# EAGLE design TBEAM_V10_Simple (EAGLE 9.6.2)

## Sheet 1 of 2
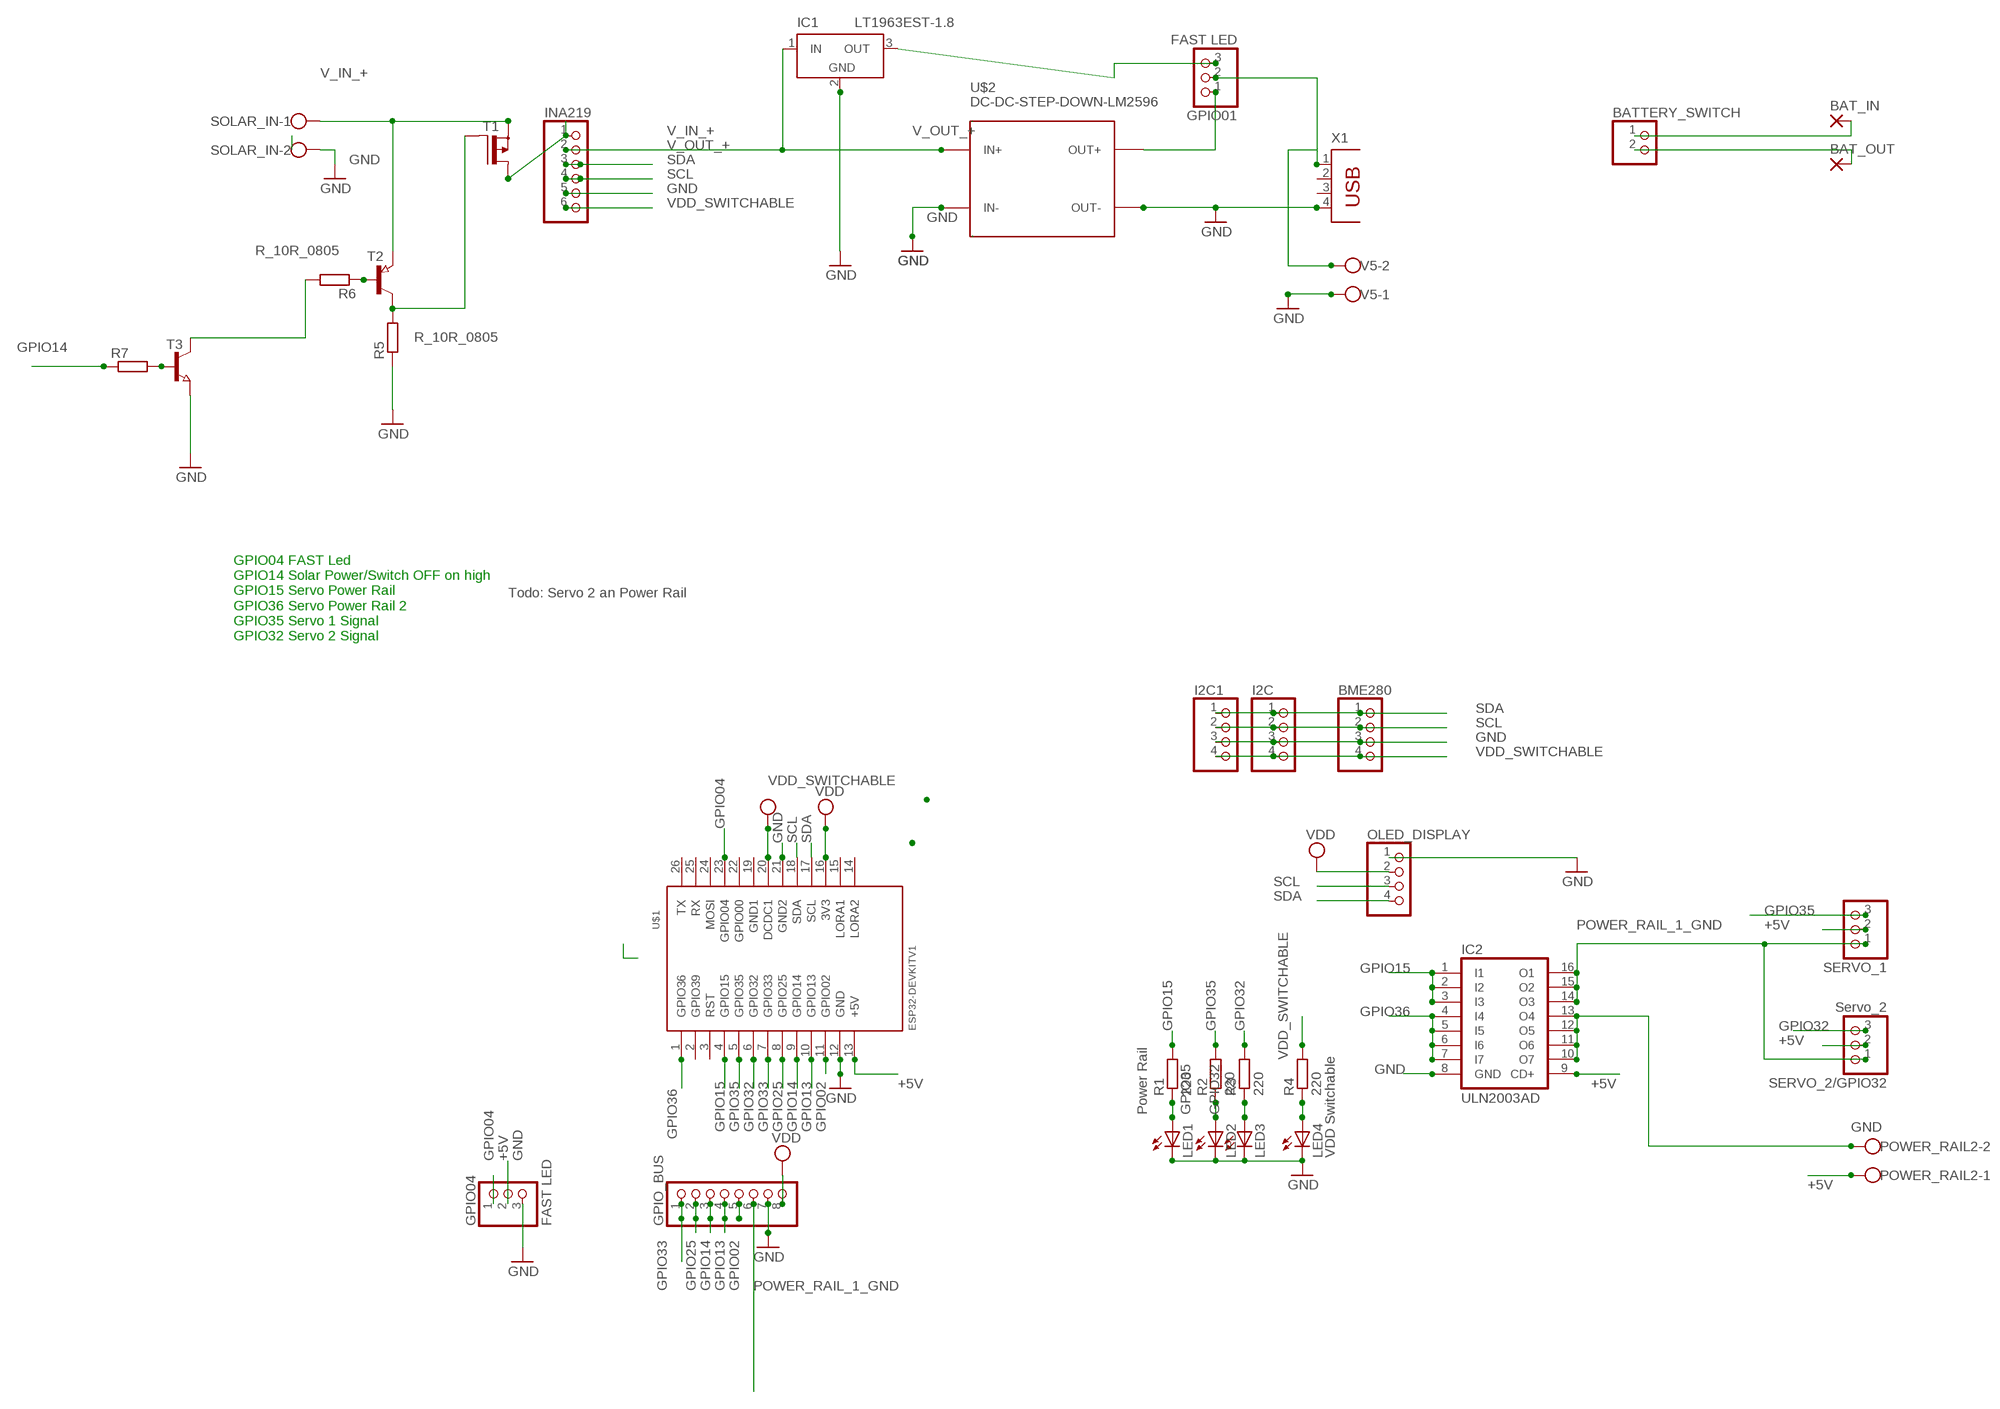
[diagram p0: schematic, sheet 1]

### Parts
BAT_IN  SMD5  [SMD2,54-5,08]
BAT_OUT  SMD5  [SMD2,54-5,08]
BATTERY_SWITCH  PINHD-1X2  [1X02]
BME280  PINHD-1X4  [1X04]
GPIO01  FAST LED  PINHD-1X3  [1X03]
GPIO04  FAST LED  PINHD-1X3  [1X03]
GPIO_BUS  PINHD-1X8  [1X08]
I2C  PINHD-1X4  [1X04]
I2C1  PINHD-1X4  [1X04]
IC1  LT1963EST-1.8  [SOT223]
IC2  ULN2003AD  [SO16]
INA219  PINHD-1X6  [1X06]
LED1  Power Rail  LEDSML1206  [SML1206]
LED2  GPIO35  LEDSML1206  [SML1206]
LED3  GPIO32  LEDSML1206  [SML1206]
LED4  VDD Switchable  LEDSML1206  [SML1206]
OLED_DISPLAY  PINHD-1X4  [1X04]
POWER_RAIL2  W237-102  [W237-102]
R1  220  R-EU_R1206  [R1206]
R2  220  R-EU_R1206  [R1206]
R3  220  R-EU_R1206  [R1206]
R4  220  R-EU_R1206  [R1206]
R5  R_10R_0805  [R0805]
R6  R_10R_0805  [R0805]
R7  R_1.8K_0805  [R0805]
R8  R_1.8K_0805  [R0805]
SERVO_1  PINHD-1X3  [1X03]
SERVO_2/GPIO32  Servo_2  PINHD-1X3  [1X03]
SOLAR_IN  W237-102  [W237-102]
T1  T_P-MOSFET_AO3401A_ALPHA_SOT23-GSD  [SOT23]
T2  T_PNP_SS8550-Y2_CHANGJ_SOT23-BEC  [SOT23]
T3  T_NPN_SS8050_CHANGJ_SOT23-BEC  [SOT23]
U$1  ESP32DEVKITV1  [ESP32-DEVKITV1]
U$2  DC-DC-STEP-DOWN-LM2596  [DC-DC-STEP-DOWN-LM2596]
V5  W237-102  [W237-102]
X1  PN87520  [PN87520]

### Nets
+5V: GPIO04.2 IC2.9(CD+) POWER_RAIL2.1 SERVO_1.2 SERVO_2/GPIO32.2 U$1.13(+5V)
BUCK-CONVERTER: GPIO01.1 U$2.OUT+
GND: BME280.3 GPIO04.3 GPIO_BUS.7 I2C1.3 I2C.3 IC1.2(GND) IC2.8(GND) INA219.5 LED1.C LED2.C LED3.C LED4.C OLED_DISPLAY.1 R5.1 SOLAR_IN.2 T3.2(E) U$1.12(GND) U$1.21(GND2) U$2.IN- U$2.OUT- V5.1 X1.4
GPIO02: GPIO_BUS.5 U$1.11(GPIO02)
GPIO04: GPIO04.1 U$1.23(GPIO04)
GPIO13: GPIO_BUS.4 U$1.10(GPIO13)
GPIO14: GPIO_BUS.3 R7.1 R8.1 U$1.9(GPIO14)
GPIO15: IC2.1(I1) IC2.2(I2) IC2.3(I3) R1.2 U$1.4(GPIO15)
GPIO25: GPIO_BUS.2 U$1.8(GPIO25)
GPIO32: R3.2 SERVO_2/GPIO32.3 U$1.6(GPIO32)
GPIO33: GPIO_BUS.1 U$1.7(GPIO33)
GPIO35: R2.2 SERVO_1.3 U$1.5(GPIO35)
GPIO36: IC2.4(I4) IC2.5(I5) IC2.6(I6) IC2.7(I7) U$1.1(GPIO36)
N$4: LED1.A R1.1
N$5: LED2.A R2.1
N$6: LED3.A R3.1
N$8: GPIO01.2 V5.2 X1.1
N$9: BAT_IN.1(P) BATTERY_SWITCH.1
N$10: BAT_OUT.1(P) BATTERY_SWITCH.2
N$11: LED4.A R4.1
N$12: IC2.10(O7) IC2.11(O6) IC2.12(O5) IC2.13(O4) POWER_RAIL2.2
N$13: SOLAR_IN.1 T1.2(S) T2.2(E)
N$14: GPIO01.3 IC1.3(OUT)
N$15: R5.2 T1.1(G) T2.3(C)
N$16: R6.1 T2.1(B)
N$17: R6.2 T3.3(C)
N$18: R7.2 R8.2 T3.1(B)
POWER_RAIL_1_GND: GPIO_BUS.6 IC2.14(O3) IC2.15(O2) IC2.16(O1) SERVO_1.1 SERVO_2/GPIO32.1
SCL: BME280.2 I2C1.2 I2C.2 INA219.4 OLED_DISPLAY.3 U$1.18(SDA)
SDA: BME280.1 I2C1.1 I2C.1 INA219.3 OLED_DISPLAY.4 U$1.17(SCL)
V_IN_+: INA219.1 T1.3(D)
V_OUT_+: IC1.1(IN) INA219.2 U$2.IN+
VDD: GPIO_BUS.8 OLED_DISPLAY.2 U$1.16(3V3)
VDD_SWITCHABLE: BME280.4 I2C1.4 I2C.4 INA219.6 R4.2 U$1.20(DCDC1) ; supply symbol labelled VDD
Unconnected: U$1.2(GPIO39) U$1.3(RST) U$1.14(LORA2) U$1.15(LORA1) U$1.19(GND1) U$1.22(GPIO00) U$1.24(MOSI) U$1.25(RX) U$1.26(TX) X1.2 X1.3

### Notes on the sheet
- Todo: Servo 2 an Power Rail
- GPIO04 FAST Led
  GPIO14 Solar Power/Switch OFF on high
  GPIO15 Servo Power Rail
  GPIO36 Servo Power Rail 2
  GPIO35 Servo 1 Signal
  GPIO32 Servo 2 Signal

## Sheet 2 of 2

## Power pins joined to a net without a drawn wire
GND: IC1.4(GND)

## Library data of the parts
BAT_IN BAT_OUT = wirepad:SMD5: SMD PAD
BATTERY_SWITCH = pinhead:PINHD-1X2: PIN HEADER
BME280 I2C I2C1 OLED_DISPLAY = pinhead:PINHD-1X4: PIN HEADER
GPIO01 GPIO04 SERVO_1 SERVO_2/GPIO32 = pinhead:PINHD-1X3: PIN HEADER
GPIO_BUS = pinhead:PINHD-1X8: PIN HEADER
IC1 = linear-technology:LT1963EST: 1.5A, Low Noise, Fast Transient Response LDO Regulator Source: http://www.linear.com/pc/downloadDocument.do?navId=H0,C3,P2222,D3148; MPN: LT1963EST-1.8; OC_FARNELL: 1503436; OC_NEWARK: 57M7538
IC2 = uln-udn:ULN2003A: DRIVER ARRAY
INA219 = pinhead:PINHD-1X6: PIN HEADER
LED1-LED4 = led:LED: LED OSRAM: - CHIPLED LG R971, LG N971, LY N971, LG Q971, LY Q971, LO R971, LY R971 LH N974, LH R974 LS Q976, LO Q976, LY Q976 LO Q996 - Hyper CHIPLED LW Q18S LB Q993, LB Q99A, LB R99A - SideLED LS A670, LO A670, LY A670, LG A670, LP A670 LB A673, LV A673, LT A673, LW A673 LH A674 LY A675 LS A676, LA A676, LO A676, LY A676, LW A676 LS A679, LY A679, LG A679 - Hyper Micro SIDELED® LS Y876, LA Y876, LO Y876, LY Y876 LT Y87S - SmartLED LW L88C, LW L88S LB L89C, LB L89S, LG L890 LS L89K, LO L89K, LY L89K LS L896, LA L896, LO L896, LY L896 - TOPLED LS T670, LO T670, LY T670, LG T670, LP T670 LSG T670, LSP T670, LSY T670, LOP T670, LYG T670 LG T671, LOG T671, LSG T671 LB T673, LV T673, LT T673, LW T673 LH T674 LS T676, LA T676, LO T676, LY T676, LB T676, LH T676, LSB T676, LW T676 LB T67C, LV T67C, LT T67C, LS T67K, LO T67K, LY T67K, LW E67C LS E67B, LA E67B, LO E67B, LY E67B, LB E67C, LV E67C, LT E67C LW T67C LS T679, LY T679, LG T679 LS T770, LO T770, LY T770, LG T770, LP T770 LB T773, LV T773, LT T773, LW T773 LH T774 LS E675, LA E675, LY E675, LS T675 LS T776, LA T776, LO T776, LY T776, LB T776 LHGB T686 LT T68C, LB T68C - Hyper Mini TOPLED® LB M676 - Mini TOPLED Santana® LG M470 LS M47K, LO M47K, LY M47K Source: http://www.osram.convergy.de LUXEON: - LUMILED® LXK2-PW12-R00, LXK2-PW12-S00, LXK2-PW14-U00, LXK2-PW14-V00 LXK2-PM12-R00, LXK2-PM12-S00, LXK2-PM14-U00 LXK2-PE12-Q00, LXK2-PE12-R00, LXK2-PE12-S00, LXK2-PE14-T00, LXK2-PE14-U00 LXK2-PB12-K00, LXK2-PB12-L00, LXK2-PB12-M00, LXK2-PB14-N00, LXK2-PB14-P00, LXK2-PB14-Q00 LXK2-PR12-L00, LXK2-PR12-M00, LXK2-PR14-Q00, LXK2-PR14-R00 LXK2-PD12-Q00, LXK2-PD12-R00, LXK2-PD12-S00 LXK2-PH12-R00, LXK2-PH12-S00 LXK2-PL12-P00, LXK2-PL12-Q00, LXK2-PL12-R00 Source: www.luxeon.com KINGBRIGHT: KA-3528ASYC Source: www.kingbright.com
POWER_RAIL2 SOLAR_IN V5 = con-wago-500:W237-102: WAGO SCREW CLAMP; MPN: 237-102; OC_FARNELL: unknown; OC_NEWARK: 70K9898
R1-R4 = resistor:R-EU_: RESISTOR, European symbol
R5 R6 = JLC PCB Basic Parts_loc:R_: Resistor General purpose SMD Resistor; LCSC_DATASHEET: https://datasheet.lcsc.com/lcsc/2110251730_UNI-ROYAL-Uniroyal-Elec-0805W8F100JT5E_C17415.pdf; LCSC_PART: C17415; LCSC_ROTATION_CCW: 0; LCSC_STOCK: 868321; PROPERTIES: ±1% 1/8W Thick Film Resistors 150V ±200ppm -55°C~+155°C 10Ohm 0805 ROHS
R7 R8 = JLC PCB Basic Parts_loc:R_: Resistor General purpose SMD Resistor; LCSC_DATASHEET: https://datasheet.lcsc.com/lcsc/2110251730_UNI-ROYAL-Uniroyal-Elec-0805W8F1801T5E_C17398.pdf; LCSC_PART: C17398; LCSC_ROTATION_CCW: 0; LCSC_STOCK: 115868; PROPERTIES: ±1% 125mW Thick Film Resistors 150V ±100ppm -55°C~+155°C 1.8kOhm 0805 ROHS
T1 = JLC PCB Basic Parts_loc:T_P-MOSFET_: Transistor P-MOSFET; LCSC_DATASHEET: https://datasheet.lcsc.com/lcsc/1810171817_Alpha---Omega-Semicon-AO3401A_C15127.pdf; LCSC_PART: C15127; LCSC_ROTATION_CCW: 180; LCSC_STOCK: 67241; PROPERTIES: 30V 4A 44mOhm@10V,4.3A 1.4W 1.3V@250A P Channel SOT-23-3L MOSFETs ROHS
T2 = JLC PCB Basic Parts_loc:T_PNP_: Transistor PNP; LCSC_DATASHEET: https://datasheet.lcsc.com/lcsc/1810161212_Changjiang-Electronics-Tech--CJ-SS8550-Y2_C8542.pdf; LCSC_PART: C8542; LCSC_ROTATION_CCW: 180; LCSC_STOCK: 416493; PROPERTIES: 25V 300mW 1.5A 200@100mA,1V 100MHz 500mV@800mA,80mA PNP +150°C@(Tj) SOT-23(SOT-23-3) Bipolar Transistors - BJT ROHS
T3 = JLC PCB Basic Parts_loc:T_NPN_: Transistor NPN; LCSC_DATASHEET: https://datasheet.lcsc.com/lcsc/1811052004_Changjiang-Electronics-Tech--CJ-SS8050_C2150.pdf; LCSC_PART: C2150; LCSC_ROTATION_CCW: 180; LCSC_STOCK: 1125240; PROPERTIES: 25V 300mW 1.5A 200@100mA,1V 100MHz 500mV@800mA,80mA NPN +150°C@(Tj) SOT-23(SOT-23-3) Bipolar Transistors - BJT ROHS
U$1 = TTGO T-Beam V10:ESP32DEVKITV1
U$2 = diy-modules:DC-DC-STEP-DOWN-LM2596: DC/DC Step-Down Regulator based on LM2596-ADJ chip LM2596 datasheet available here: http://www.ti.com/lit/ds/symlink/lm2596.pdf Click here to find device on ebay.com <http://www.ebay.com/sch/lm2596+power+regulator>
X1 = con-berg:PN87520: BERG USB connector; OC_FARNELL: unknown; OC_NEWARK: unknown

## Board
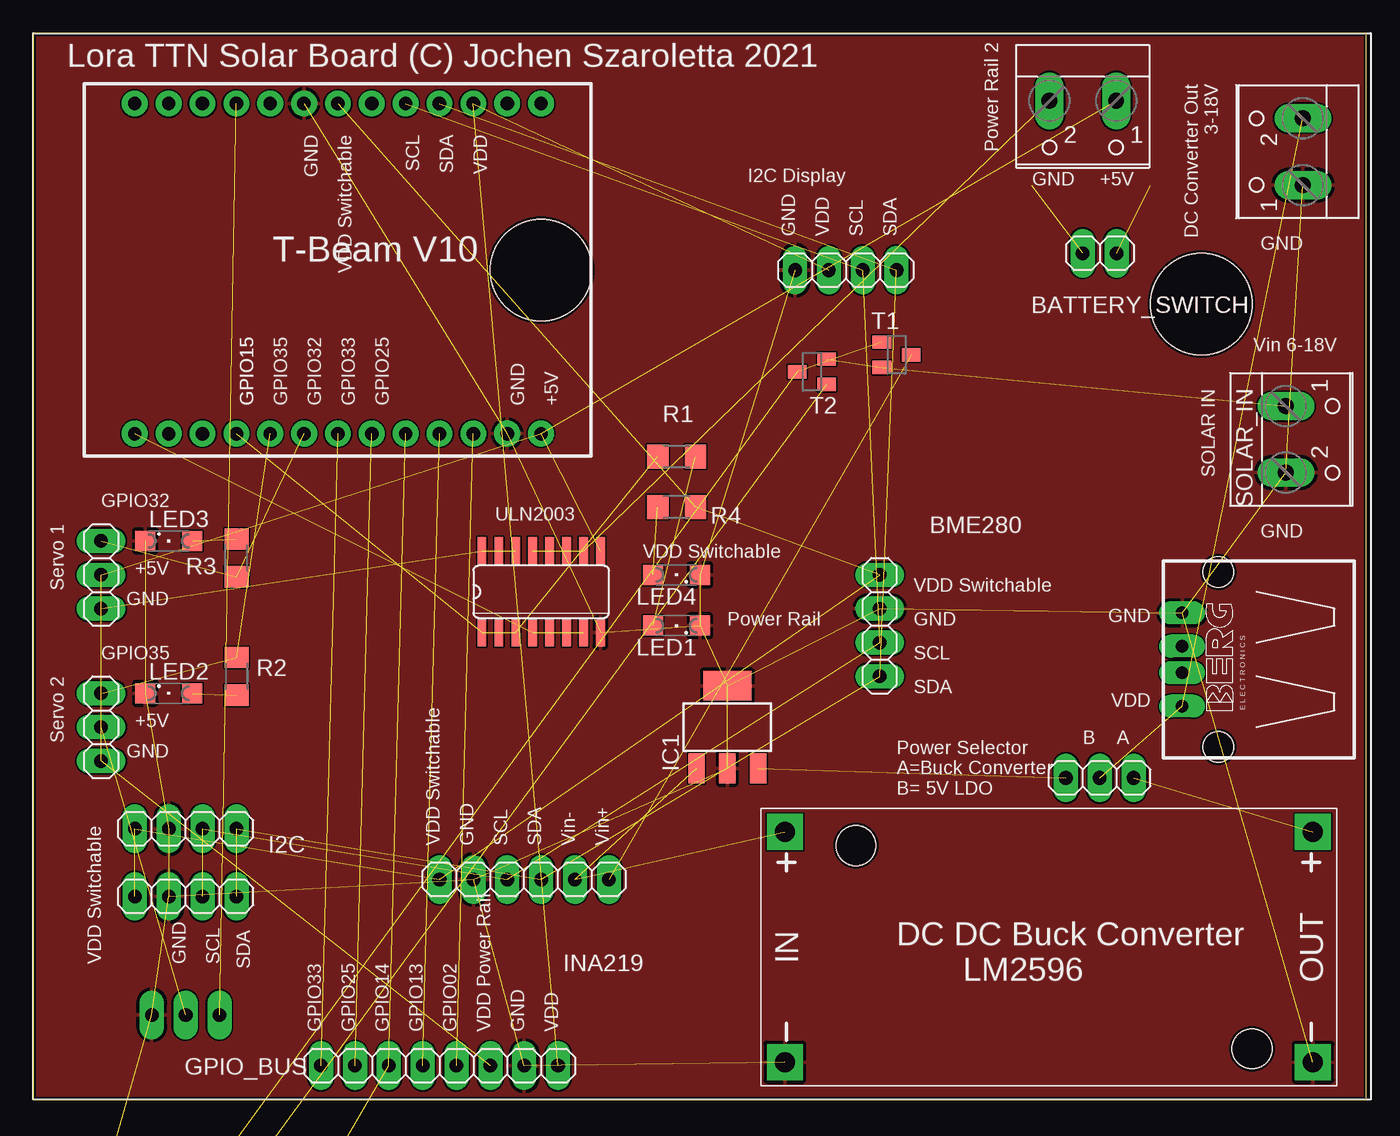
[diagram p1: board, top side]
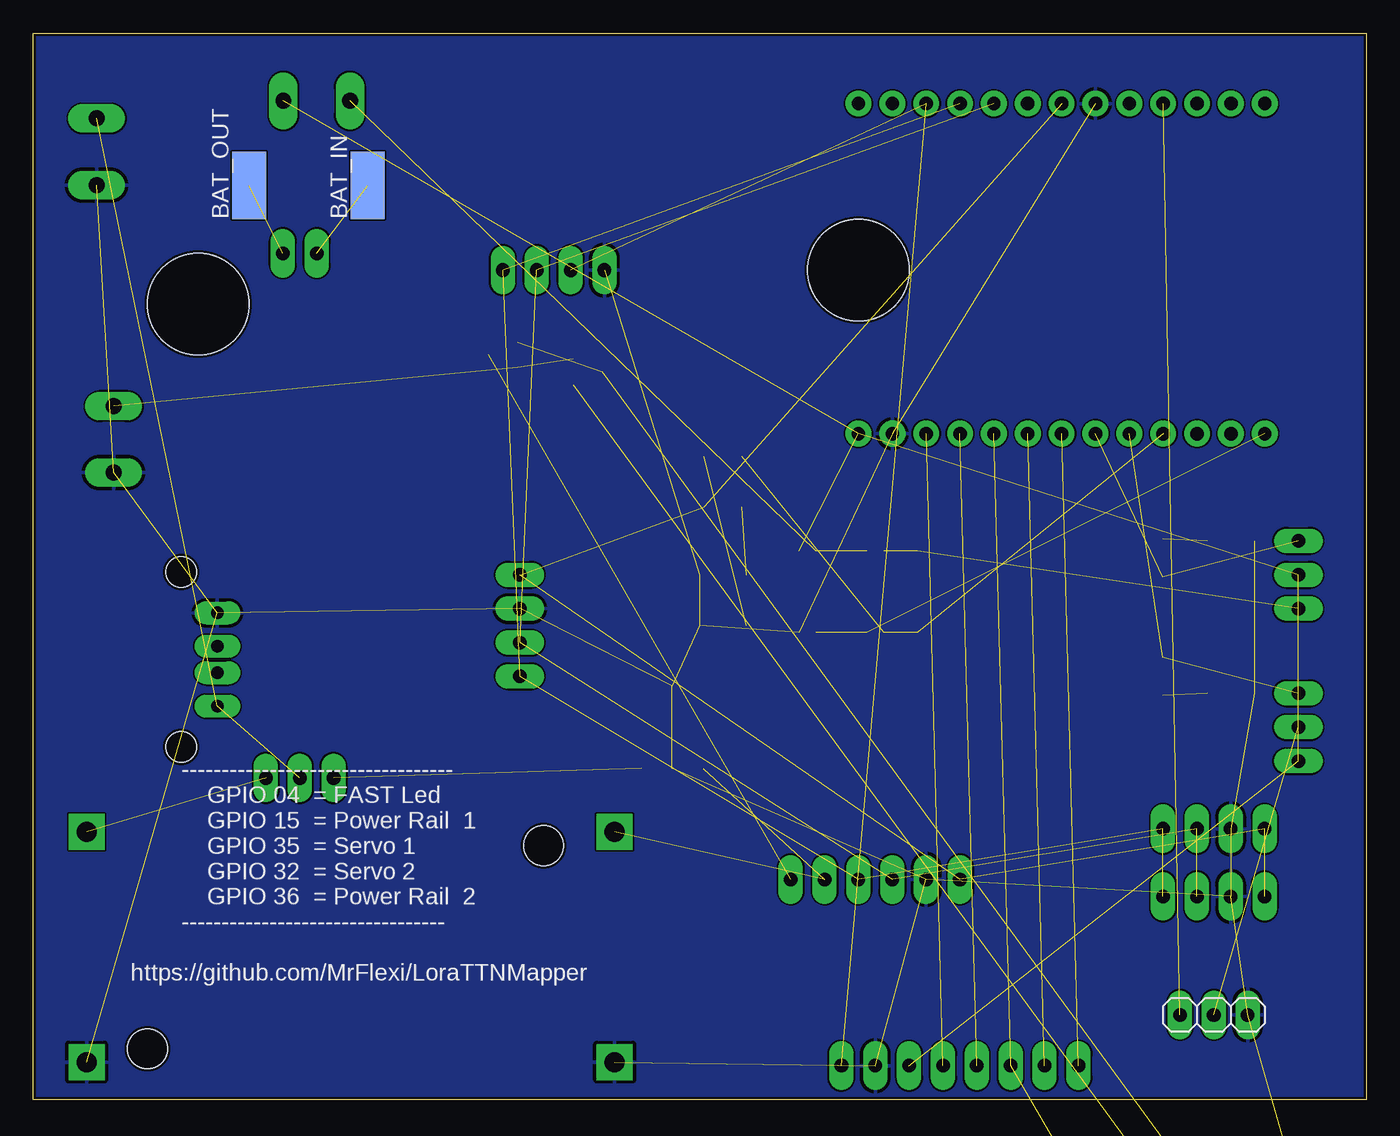
[diagram p2: board, bottom side, seen from below]

Size 100 x 80 mm. Coordinates in mm from the lower left corner, seen from the top.
Outline: 0,0 100,0 100,80 0,80 0,0
Copper layers (1*16): Top 0.035mm / dielectric 1.6mm / Bottom 0.035mm
Design rules "jlcpcb-2layers": minimum track width 5mil, minimum drill 0.3mm, track to track 5mil, track to pad 5mil, pad to pad 5mil, via to via 5mil, smd to smd 5mil, copper to edge 0.2mm, drill to drill 6mil, minimum pad ring 10mil, minimum via ring 3mil, stop-mask expansion 4mil, vias tented up to drill 0mil, thermal gap 10mil
Holes 7.62 mm at 38.1,62.23 87.63,59.69

### Footprints (pad centres in the part's own frame; a part is rotated, then mirrored left to right if it is on the bottom)
SMD2,54-5,08 = smd 2.54 x 5.08: 1 0,0
1X02 = drill 1.016 long: 1 -1.27,0; 2 1.27,0
1X04 = drill 1.016 long: 1 -3.81,0; 2 -1.27,0; 3 1.27,0; 4 3.81,0
1X03 = drill 1.016 long: 1 -2.54,0; 2 0,0; 3 2.54,0
1X08 = drill 1.016 long: 1 -8.89,0; 2 -6.35,0; 3 -3.81,0; 4 -1.27,0; 5 1.27,0; 6 3.81,0; 7 6.35,0; 8 8.89,0
SOT223 = smd 1.219 x 2.235: 1 -2.311,-3.099; 2 0,-3.099; 3 2.311,-3.099 | smd 3.6 x 2.2: 4 0,3.099
SO16 = smd 0.66 x 2.032: 1 -4.445,-3.073; 2 -3.175,-3.073; 3 -1.905,-3.073; 4 -0.635,-3.073; 5 0.635,-3.073; 6 1.905,-3.073; 7 3.175,-3.073; 8 4.445,-3.073; 9 4.445,3.073; 10 3.175,3.073; 11 1.905,3.073; 12 0.635,3.073; 13 -0.635,3.073; 14 -1.905,3.073; 15 -3.175,3.073; 16 -4.445,3.073
1X06 = drill 1.016 long: 1 -6.35,0; 2 -3.81,0; 3 -1.27,0; 4 1.27,0; 5 3.81,0; 6 6.35,0
SML1206 = smd 1.5 x 1.5: A 1.75,0; C -1.75,0
W237-102 = drill 1.194 long: 1 -2.5,-1.27; 2 2.5,-1.27
R1206 = smd 1.6 x 1.803: 1 -1.422,0; 2 1.422,0
R0805 = smd 1.3 x 1.5: 1 -0.95,0; 2 0.95,0
SOT23 = smd 1.4 x 1: 1 -1.1,0.95; 2 -1.1,-0.95; 3 1.1,0
ESP32-DEVKITV1 = drill 1 pad 1.93: 1 -22.87,-13.54; 2 -20.33,-13.54; 3 -17.79,-13.54; 4 -15.25,-13.54; 5 -12.71,-13.54; 6 -10.17,-13.54; 7 -7.63,-13.54; 8 -5.09,-13.54; 9 -2.55,-13.54; 10 -0.01,-13.54; 11 2.53,-13.54; 12 5.07,-13.54; 13 7.61,-13.54; 14 7.61,11.23; 15 5.07,11.23; 16 2.53,11.23; 17 -0.01,11.23; 18 -2.55,11.23; 19 -5.09,11.23; 20 -7.63,11.23; 21 -10.17,11.23; 22 -12.71,11.23; 23 -15.25,11.23; 24 -17.79,11.23; 25 -20.33,11.23; 26 -22.87,11.23
DC-DC-STEP-DOWN-LM2596 = drill 1.5 pad 2.5 square: IN+ -19.812,8.636; IN- -19.812,-8.636; OUT+ 19.812,8.636; OUT- 19.812,-8.636 | hole 3: -14.478,7.62; 15.24,-7.62
PN87520 = drill 0.95 long: 1 -3.5,2.71; 2 -1,2.71; 3 1,2.71; 4 3.5,2.71 | hole 2.3: -6.57,0; 6.57,0

### Placement (x,y rotation side)
BAT_IN  74.93,68.58 0 bottom
BAT_OUT  83.82,68.58 0 bottom
BATTERY_SWITCH  80.01,63.5 0 top
BME280  63.5,35.56 90 top
GPIO01  80.01,24.13 180 top
GPIO04  11.43,6.35 0 bottom
GPIO_BUS  30.48,2.54 0 top
I2C  11.43,20.32 180 top
I2C1  11.43,15.24 180 top
IC1  52.07,27.94 0 top
IC2  38.1,38.1 0 top
INA219  36.83,16.51 180 top
LED1  48.26,35.56 180 top
LED2  10.16,30.48 0 top
LED3  10.16,41.91 0 top
LED4  48.26,39.37 180 top
OLED_DISPLAY  60.96,62.23 0 top
POWER_RAIL2  78.74,73.66 180 top
R1  48.26,48.26 180 top
R2  15.24,31.75 90 top
R3  15.24,40.64 270 top
R4  48.26,44.45 0 top
R5  2.54,-19.05 0 top  (outside the outline)
R6  2.54,-25.4 0 top  (outside the outline)
R7  2.54,-40.64 0 top  (outside the outline)
R8  2.54,-46.99 0 top  (outside the outline)
SERVO_1  5.08,27.94 90 top
SERVO_2/GPIO32  5.08,39.37 90 top
SOLAR_IN  95.25,49.53 270 top
T1  64.77,55.88 0 top
T2  58.42,54.61 180 top
T3  2.54,-33.02 0 top  (outside the outline)
U$1  30.48,63.5 0 top
U$2  76.2,11.43 0 top
V5  93.98,71.12 90 top
X1  88.9,33.02 90 top

### Tracks (layer width: path | path; a pad name or v marks a point on that pad's centre or on a via)
+5V  (5 unrouted)
BUCK-CONVERTER  (1 unrouted)
GND  (22 unrouted)
  pour Top: 1.27,80.01 100.33,80.01 100.33,0 0,0 0,80.01
  pour Bottom: 0,80.01 100.33,80.01 100.33,0 0,0
GPIO02  (1 unrouted)
GPIO04  (1 unrouted)
GPIO13  (1 unrouted)
GPIO14  (3 unrouted)
GPIO15  (4 unrouted)
GPIO25  (1 unrouted)
GPIO32  (2 unrouted)
GPIO33  (1 unrouted)
GPIO35  (2 unrouted)
GPIO36  (4 unrouted)
N$4  (1 unrouted)
N$5  (1 unrouted)
N$6  (1 unrouted)
N$8  (2 unrouted)
N$9  (1 unrouted)
N$10  (1 unrouted)
N$11  (1 unrouted)
N$12  (4 unrouted)
N$13  (2 unrouted)
N$14  (1 unrouted)
N$15  (2 unrouted)
N$16  (1 unrouted)
N$17  (1 unrouted)
N$18  (2 unrouted)
POWER_RAIL_1_GND  (5 unrouted)
SCL  (5 unrouted)
SDA  (5 unrouted)
V_IN_+  (1 unrouted)
V_OUT_+  (2 unrouted)
VDD  (2 unrouted)
VDD_SWITCHABLE  (5 unrouted)

### Text on the board
tPlace: DC Converter Out / 3-18V | GND | VDD Switchable | SCL | SDA | VDD | Power Rail 2 | I2C Display | GND | +5V | GND | VDD | SCL | SDA | GND | Vin 6-18V | SOLAR IN | GPIO15 | GPIO15 | GPIO35 | GPIO32 | GPIO33 | GPIO25 | GND | +5V | GPIO32 | ULN2003 | Servo 1 | GND | +5V | GND | VDD Switchable | GND | GND | GPIO35 | SCL | Servo 2 | SDA | VDD | +5V | GND | B | A | Power Selector / A=Buck Converter / B= 5V LDO | VDD Switchable | GND | SCL | SDA | Vin- | Vin+ | SDA | VDD Switchable | GND | SCL | DC DC Buck Converter / LM2596 | GPIO33 | GPIO25 | GPIO14 | GPIO13 | GPIO02 | VDD Power Rail | GND | VDD
bPlace: ---------------------------------- / GPIO 04 = FAST Led / GPIO 15 = Power Rail 1 / GPIO 35 = Servo 1 / GPIO 32 = Servo 2 / GPIO 36 = Power Rail 2 / --------------------------------- | https://github.com/MrFlexi/LoraTTNMapper
tNames: Lora TTN Solar Board (C) Jochen Szaroletta 2021 | VDD Switchable | Power Rail
bValues: GND | +5v | GPIO04